# Altium project l297_l298.PrjPCB
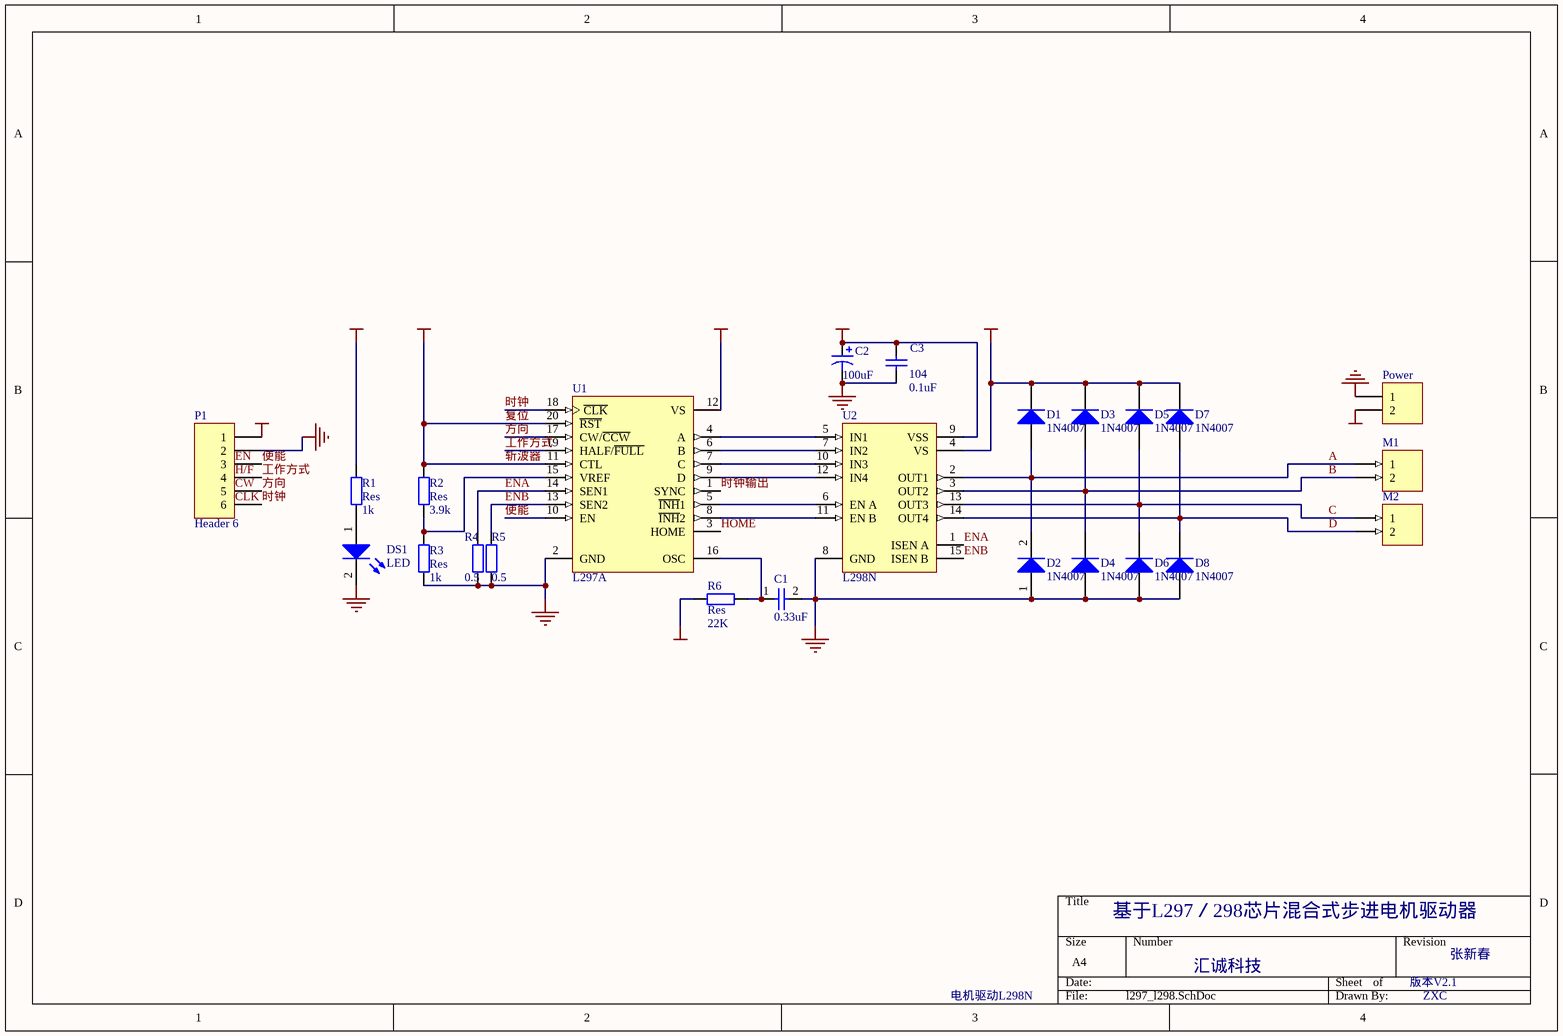
[diagram p0: l297_l298.SchDoc]
1 sheet, 24 parts. Net scope: global (net labels, ports and power ports of the same name join across sheets).
Board file: l297_l298.PcbDoc

## Sheet l297_l298.SchDoc
size A4

### Parts
C1  value 0.33uF  [C-DJ-4]
C2  value 100uF  [C-DJ-6]
C3  104  value 0.1uF  [CPDR]
D1  1N4007  [D-ZL-10]
D2  1N4007  [D-ZL-10]
D3  1N4007  [D-ZL-10]
D4  1N4007  [D-ZL-10]
D5  1N4007  [D-ZL-10]
D6  1N4007  [D-ZL-10]
D7  1N4007  [D-ZL-10]
D8  1N4007  [D-ZL-10]
DS1  LED  [CPDR]
M1  (no value)  [JK128_2]
M2  (no value)  [JK128_2]
P1  Header 6  [HDR1X6]
Power  (no value)  [JK128_2]
R1  Res  value 1k  [CPDR]
R2  Res  value 3.9k  [CPDR]
R3  Res  value 1k  [CPDR]
R4  value 0.5  [ZCDZl]
R5  value 0.5  [ZCDZl]
R6  Res  value 22K  [CPDR]
U1  L297A  [DIP-20]
U2  L298N  [L298N]

### Nets
GND: C1.2 C2.2 C3.1 D2.1(A) D4.1(A) D6.1(A) D8.1(A) DS1.2(K) P1.2 Power.1 R3.2 R4.2 R5.2 U1.2(GND) U2.8(GND)
VCC: D1.2(K) D3.2(K) D5.2(K) D7.2(K) Power.2 U2.4(VS)
复位: C2.1 C3.2 P1.1 R1.1 R2.1 R6.2 U1.11(CTL) U1.12(VS) U1.20(~{RST}) U2.9(VSS)  [also labelled +5V, 斩波器]
A: D1.1(A) D2.2(K) M1.1 U2.2(OUT1)
B: D3.1(A) D4.2(K) M1.2 U2.3(OUT2)
C: D5.1(A) D6.2(K) M2.1 U2.13(OUT3)
D: D7.1(A) D8.2(K) M2.2 U2.14(OUT4)
ENA: R4.1 U1.14(SEN1) U2.1(ISEN_A)
ENB: R5.1 U1.13(SEN2) U2.15(ISEN_B)
HOME: U1.3(HOME)
使能: P1.3 U1.10(EN)
工作方式: P1.4 U1.19(HALF/~{FULL})
方向: P1.5 U1.17(CW/~{CCW})
时钟: P1.6 U1.18(~{CLK})
时钟输出: U1.1(SYNC)
NetC1_1: C1.1 R6.1 U1.16(OSC)
NetDS1_1: DS1.1(A) R1.2
NetR2_2: R2.2 R3.1 U1.15(VREF)
NetU1_4: U1.4(A) U2.5(IN1)
NetU1_5: U1.5(~{INH}1) U2.6(EN_A)
NetU1_6: U1.6(B) U2.7(IN2)
NetU1_7: U1.7(C) U2.10(IN3)
NetU1_8: U1.8(~{INH}2) U2.11(EN_B)
NetU1_9: U1.9(D) U2.12(IN4)

### Notes on the sheet
- 基于L297／298芯片混合式步进电机驱动器
- 汇诚科技
- 版本V2.1
- 张新春
- 电机驱动L298N
- ZXC
- Labels drawn without touching a wire or pin: CLK, CW, EN, H/F

### Library data of the parts
C1 C3 = Cap: Capacitor; Published: 8-Jun-2000; LatestRevisionDate: 17-Jul-2002; LatestRevisionNote: Re-released for DXP Platform.; Publisher: Altium Limited
C2 = Cap Pol3: Polarized Capacitor (Surface Mount); Published: 8-Jun-2000; LatestRevisionDate: 17-Jul-2002; LatestRevisionNote: Re-released for DXP Platform.; PackageReference: C0805; Publisher: Altium Limited
D1-D8 = Diode 1N4007: 1 Amp General Purpose Rectifier; Published: 8-Jun-2000; LatestRevisionDate: 17-Jul-2002; LatestRevisionNote: Re-released for DXP Platform.; DatasheetDocument: 1998; PackageDocument: Aug-1999; PackageReference: DO-41; Publisher: Altium Limited; Code_JEDEC: DO-204-AL
DS1 = LED: 发光二极管; Published: 8-Jun-2000; LatestRevisionDate: 17-Jul-2002; LatestRevisionNote: Re-released for DXP Platform.; Publisher: Altium Limited
M1 M2 Power = MHDR1X2: Header, 2-Pin; LatestRevisionDate: 17-Jul-2002; LatestRevisionNote: Re-released for DXP Platform.; Publisher: Altium Limited
P1 = Header 6: Header, 6-Pin; LatestRevisionDate: 17-Jul-2002; LatestRevisionNote: Re-released for DXP Platform.; Publisher: Altium Limited
R1-R6 = Res: 电阻; Published: 8-Jun-2000; LatestRevisionDate: 17-Jul-2002; LatestRevisionNote: Re-released for DXP Platform.; Publisher: Altium Limited
U1 = L297A: Stepper Motor Controller; Published: 8-Jun-2000; LatestRevisionDate: 6-Jun-2005; LatestRevisionNote: Stylized 3D Model Added.; DatasheetDocument: Aug-1996; PackageDocument: Jun-1998; PackageReference: DIP20; Publisher: Altium Limited; Code_JEDEC: MS-015-AE; ComponentLink1Description: Manufacturer Link; ComponentLink1URL: http://www.st.com/
U2 = L298N: Dual Full Bridge Driver; Published: 8-Jun-2000; LatestRevisionDate: 17-Jul-2002; LatestRevisionNote: Re-released for DXP Platform.; DatasheetDocument: Jul-1999; PackageDocument: Apr-1998; PackageReference: Multiwatt15H; Publisher: Altium Limited; ComponentLink1Description: Manufacturer Link; ComponentLink1URL: http://www.st.com/